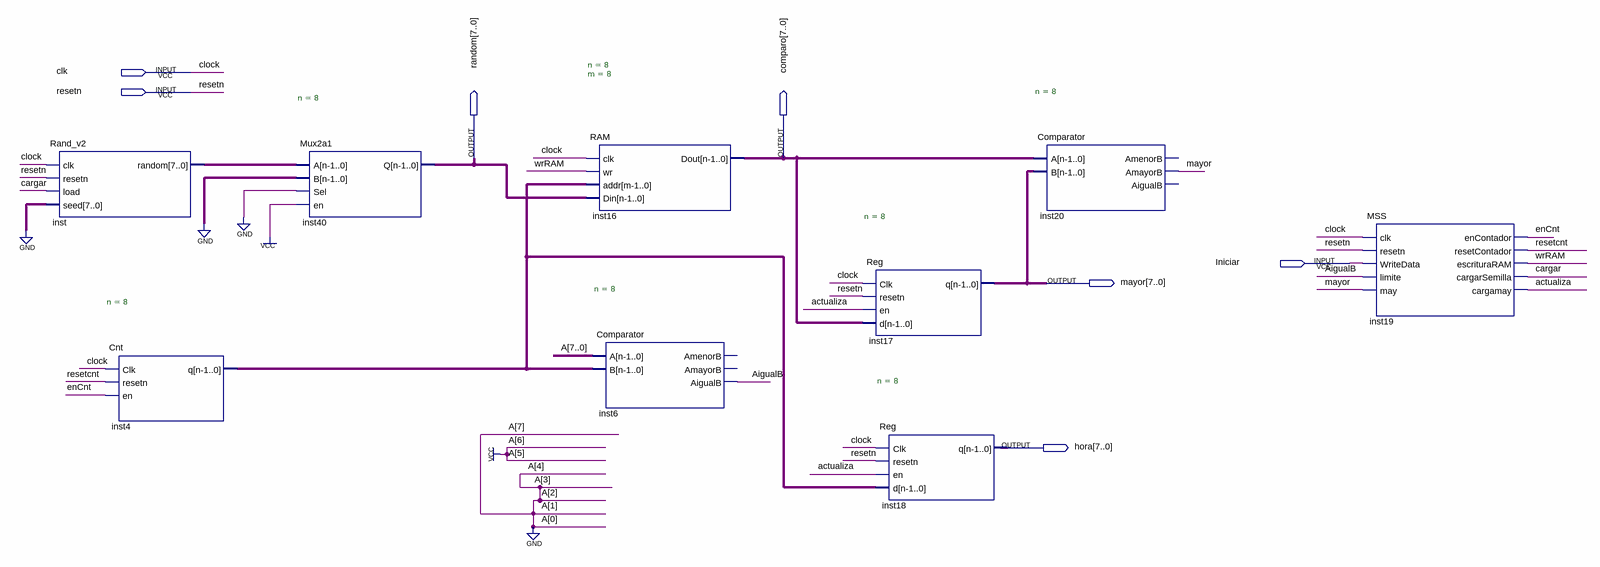
[diagram p0: schematic sheet]
// Quartus schematic Esquematico.bdf as structural Verilog: 9 symbols, 7 pins
module Esquematico (
  input  clk,
  input  resetn,
  input  Iniciar,
  output [7:0] random,
  output [7:0] comparo,
  output [7:0] mayor,
  output [7:0] hora
);

  wire actualiza, AigualB, cargar, enCnt, mayor_1bit, resetcnt, wrRAM;
  wire [7:0] inst4_q, inst_random;

  Rand_v2 inst (.clk(clk), .resetn(resetn), .load(cargar), .seed({8{1'b0}}), .random(inst_random));
  Cnt #(.n(8)) inst4 (.Clk(clk), .resetn(resetcnt), .en(enCnt), .q(inst4_q));
  Mux2a1 #(.n(8)) inst40 (.A(inst_random), .B({8{1'b0}}), .Sel(1'b0), .en(1'b1), .Q(random));
  RAM #(.n(8), .m(8)) inst16 (.clk(clk), .wr(wrRAM), .addr(inst4_q), .Din(random), .Dout(comparo));
  Comparator #(.n(8)) inst6 (.A(8'b01100000), .B(inst4_q), .AigualB(AigualB));  // open: AmenorB, AmayorB
  Reg #(.n(8)) inst17 (.Clk(clk), .resetn(resetn), .en(actualiza), .d(comparo), .q(mayor));
  Reg #(.n(8)) inst18 (.Clk(clk), .resetn(resetn), .en(actualiza), .d(inst4_q), .q(hora));
  Comparator #(.n(8)) inst20 (.A(comparo), .B(mayor), .AmayorB(mayor_1bit));  // open: AmenorB, AigualB
  MSS inst19 (
    .clk(clk), .resetn(resetn), .WriteData(Iniciar), .limite(AigualB), .may(mayor_1bit), .enContador(enCnt),
    .resetContador(resetcnt), .escrituraRAM(wrRAM), .cargarSemilla(cargar), .cargamay(actualiza));

  // Other names for the same wires on the sheet: clock = clk
endmodule
